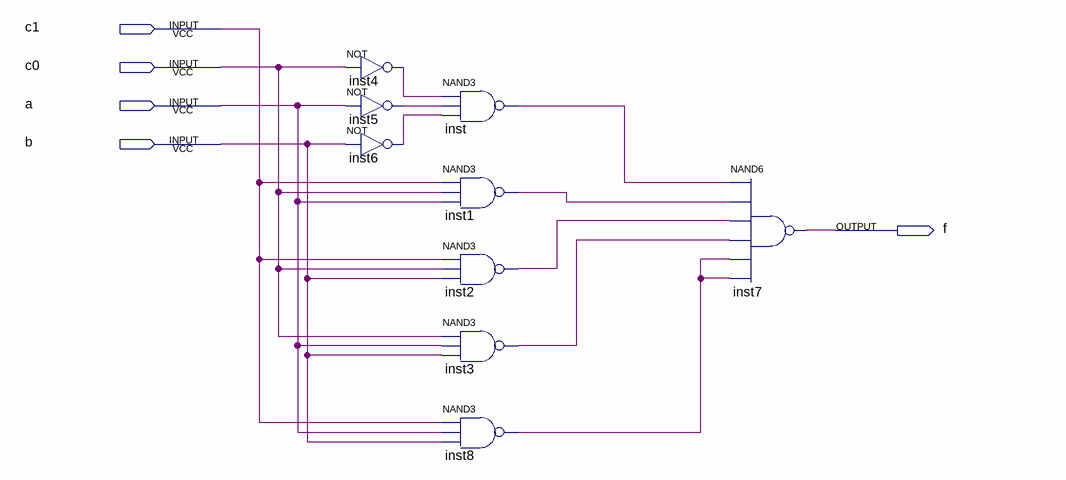
[diagram p0: schematic sheet]
// Quartus schematic prelab3q5.bdf as structural Verilog: 9 symbols, 5 pins
module prelab3q5 (
  input  c1,
  input  c0,
  input  a,
  input  b,
  output f
);

  wire inst1_out, inst2_out, inst3_out, inst4_out, inst5_out, inst6_out, inst8_out, inst_out;

  not inst4 (inst4_out, c0);
  not inst5 (inst5_out, a);
  not inst6 (inst6_out, b);
  nand inst (inst_out, inst4_out, inst5_out, inst6_out);
  nand inst1 (inst1_out, c1, c0, a);
  nand inst2 (inst2_out, c1, c0, b);
  nand inst3 (inst3_out, c0, a, b);
  nand inst8 (inst8_out, c1, a, b);
  nand inst7 (f, inst_out, inst1_out, inst2_out, inst3_out, inst8_out, inst8_out);
endmodule
